# EAGLE schematic data_pro (EAGLE 7.6.0)
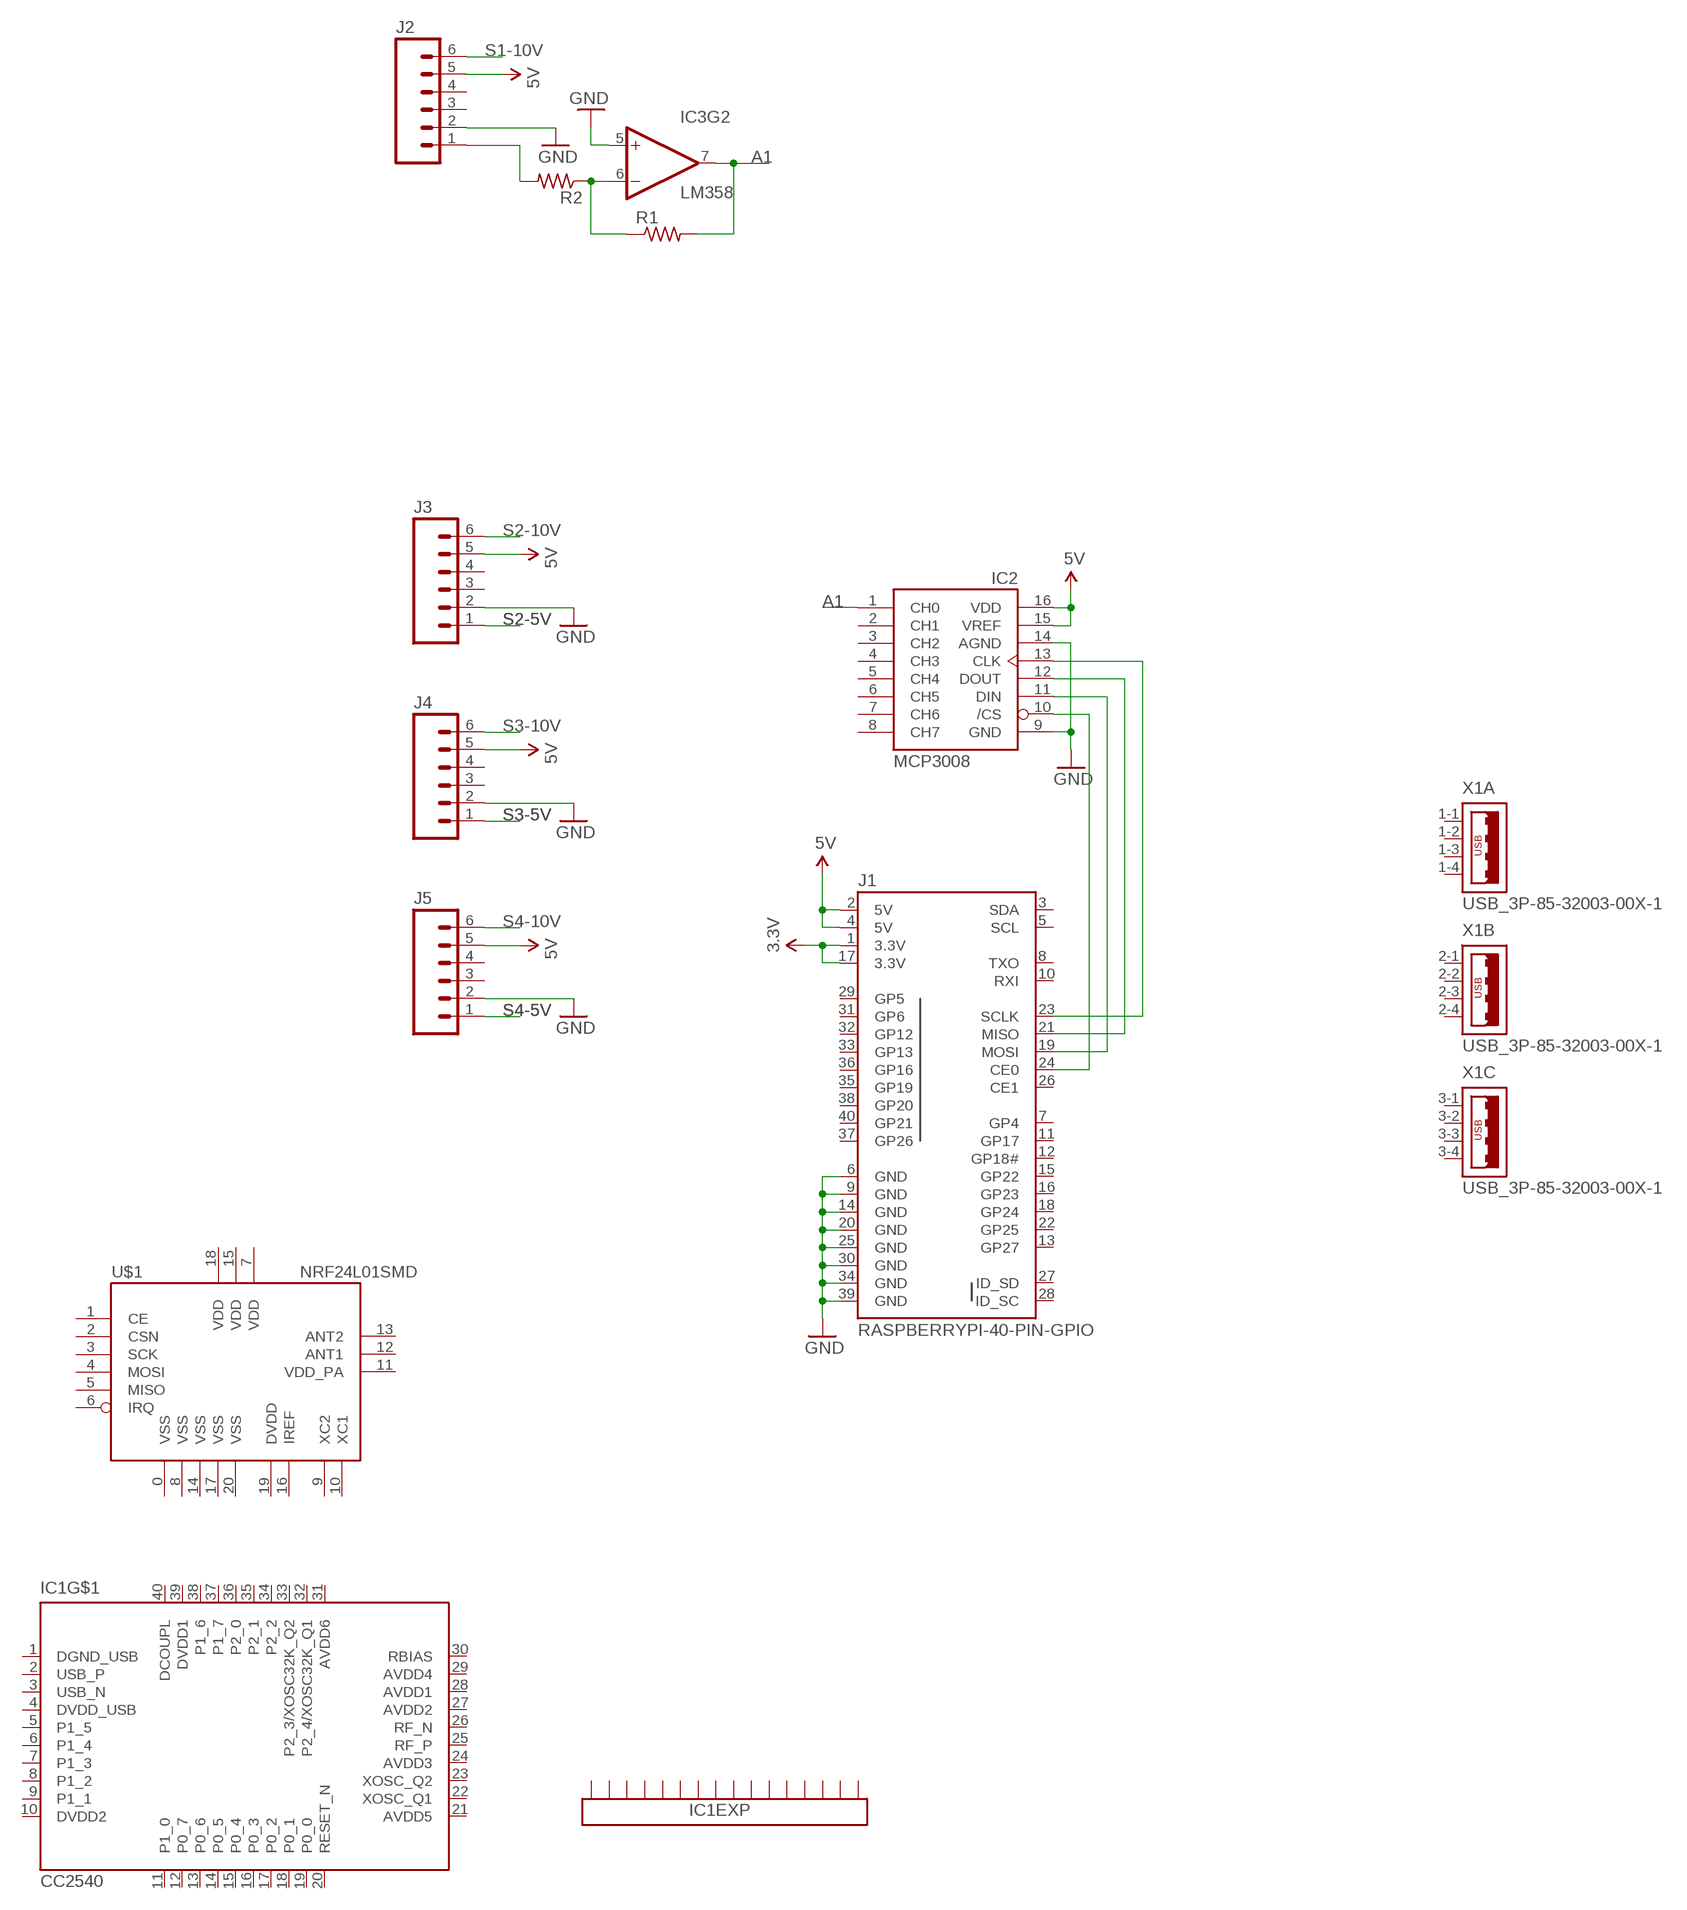
[diagram p0: schematic, sheet 1]

## Parts
IC1  CC2540  [QFN40-6X6]
IC2  MCP3008  [DIL16]
IC3  LM358  [DIP08]
J1  RASPBERRYPI-40-PIN-GPIO  [2X20-SHROUDED]
J2  M06VERNIER-ANALOG  [BTA]
J3  M06VERNIER-ANALOG  [BTA]
J4  M06VERNIER-ANALOG  [BTA]
J5  M06VERNIER-ANALOG  [BTA]
R1  R-US_R0805  [R0805]
R2  R-US_R0805  [R0805]
U$1  NRF24L01SMD  [QFN20]
X1  USB_3P-85-32003-00X-1  [85-32003-00X-1]

## Nets
3.3V: J1.1(3.3V) J1.17(3.3V)
5V: IC2.15(VREF) IC2.16(VDD) J1.2(5V) J1.4(5V) J2.5 J3.5 J4.5 J5.5
A1: IC2.1(CH0) IC3.7(OUT) R1.2
GND: IC2.9(GND) IC2.14(AGND) IC3.5(+IN) J1.6(GND) J1.9(GND) J1.14(GND) J1.20(GND) J1.25(GND) J1.30(GND) J1.34(GND) J1.39(GND) J2.2 J3.2 J4.2 J5.2
N$1: IC2.13(CLK) J1.23(SCLK)
N$2: IC2.12(DOUT) J1.21(MISO)
N$3: IC2.11(DIN) J1.19(MOSI)
N$4: IC2.10(/CS) J1.24(CE0)
N$6: IC3.6(-IN) R1.1 R2.1
S1-5V: J2.1 R2.2
S1-10V: J2.6
S2-5V: J3.1
S2-10V: J3.6
S3-5V: J4.1
S3-10V: J4.6
S4-5V: J5.1
S4-10V: J5.6
Unconnected: IC1.2(USB_P) IC1.3(USB_N) IC1.5(P1_5) IC1.6(P1_4) IC1.7(P1_3) IC1.8(P1_2) IC1.9(P1_1) IC1.11(P1_0) IC1.12(P0_7) IC1.13(P0_6) IC1.14(P0_5) IC1.15(P0_4) IC1.16(P0_3) IC1.17(P0_2) IC1.18(P0_1) IC1.19(P0_0) IC1.20(RESET_N) IC1.22(XOSC_Q1) IC1.23(XOSC_Q2) IC1.25(RF_P) IC1.26(RF_N) IC1.30(RBIAS) IC1.32(P2_4/XOSC32K_Q1) IC1.33(P2_3/XOSC32K_Q2) IC1.34(P2_2) IC1.35(P2_1) IC1.36(P2_0) IC1.37(P1_7) IC1.38(P1_6) IC1.EXP@1(EXP:EXP16) IC1.EXP@2(EXP:EXP16) IC1.EXP@3(EXP:EXP16) IC1.EXP@4(EXP:EXP16) IC1.EXP@5(EXP:EXP16) IC1.EXP@6(EXP:EXP16) IC1.EXP@7(EXP:EXP16) IC1.EXP@8(EXP:EXP16) IC1.EXP@9(EXP:EXP16) IC1.EXP@10(EXP:EXP16) IC1.EXP@11(EXP:EXP16) IC1.EXP@12(EXP:EXP16) IC1.EXP@13(EXP:EXP16) IC1.EXP@14(EXP:EXP16) IC1.EXP@15(EXP:EXP16) IC1.EXP@16(EXP:EXP16) IC2.2(CH1) IC2.3(CH2) IC2.4(CH3) IC2.5(CH4) IC2.6(CH5) IC2.7(CH6) IC2.8(CH7) IC3.1(OUT) IC3.2(-IN) IC3.3(+IN) J1.3(SDA) J1.5(SCL) J1.7(GP4) J1.8(TXO) J1.10(RXI) J1.11(GP17) J1.12(GP18#) J1.13(GP27) J1.15(GP22) J1.16(GP23) J1.18(GP24) J1.22(GP25) J1.26(CE1) J1.27(ID_SD) J1.28(ID_SC) J1.29(GP5) J1.31(GP6) J1.32(GP12) J1.33(GP13) J1.35(GP19) J1.36(GP16) J1.37(GP26) J1.38(GP20) J1.40(GP21) J2.3 J2.4 J3.3 J3.4 J4.3 J4.4 J5.3 J5.4 U$1.1(CE) U$1.2(CSN) U$1.3(SCK) U$1.4(MOSI) U$1.5(MISO) U$1.6(IRQ) U$1.9(XC2) U$1.10(XC1) U$1.12(ANT1) U$1.13(ANT2) U$1.16(IREF) X1.1-1 X1.1-2 X1.1-3 X1.1-4 X1.2-1 X1.2-2 X1.2-3 X1.2-4 X1.3-1 X1.3-2 X1.3-3 X1.3-4

## Power pins joined to a net without a drawn wire
AVDD1: IC1.28(AVDD1)
AVDD2: IC1.27(AVDD2)
AVDD3: IC1.24(AVDD3)
AVDD4: IC1.29(AVDD4)
AVDD5: IC1.21(AVDD5)
AVDD6: IC1.31(AVDD6)
DCOUPL: IC1.40(DCOUPL)
DGND_USB: IC1.1(DGND_USB)
DVDD: U$1.19(DVDD)
DVDD1: IC1.39(DVDD1)
DVDD2: IC1.10(DVDD2)
DVDD_USB: IC1.4(DVDD_USB)
V+: IC3.8(V+)
V-: IC3.4(V-)
VDD: U$1.7(VDD) U$1.15(VDD) U$1.18(VDD)
VDD_PA: U$1.11(VDD_PA)
VSS: U$1.0(VSS) U$1.8(VSS) U$1.14(VSS) U$1.17(VSS) U$1.20(VSS)

## Library data of the parts
IC1 = texas:CC2540: 2.4-GHz Bluetooth® low energy System-on-Chip Auto generated by make-symbol-device-package-bsdl.ulp Rev. 39 Source: cc2540.txt
IC2 = adafruit:MCP3008
IC3 = SparkFun-AnalogIC:LM358: Jellybean op-amp; PROD_ID: IC-09172
J1 = SparkFun-Boards:RASPBERRYPI-40-PIN-GPIO: Second Generation Raspberry Pi GPIO Header 2x20 pin connector, as found on B, B+, A+ models.
J2-J5 = SparkFun-Connectors:M06: Header 6 Standard 6-pin 0.1" header. Use with straight break away headers (SKU : PRT-00116), right angle break away headers (PRT-00553), swiss pins (PRT-00743), machine pins (PRT-00117), and female headers (PRT-00115). Molex polarized connector foot print use with SKU : PRT-08094 with associated crimp pins and housings. NOTES ON THE VARIANTS LOCK and LOCK_LONGPADS... This footprint was designed to help hold the alignment of a through-hole component (i.e. 6-pin header) while soldering it into place. You may notice that each hole has been shifted either up or down by 0.005 of an inch from it's more standard position (which is a perfectly straight line). This slight alteration caused the pins (the squares in the middle) to touch the edges of the holes. Because they are alternating, it causes a "brace" to hold the component in place. 0.005 has proven to be the perfect amount of "off-center" position when using our standard breakaway headers. Although looks a little odd when you look at the bare footprint, once you have a header in there, the alteration is very hard to notice. Also,if you push a header all the way into place, it is covered up entirely on the bottom side. This idea of altering the position of holes to aid alignment will be further integrated into the Sparkfun Library for other footprints. It can help hold any component with 3 or more connection pins.
R1 R2 = resistor:R-US_: RESISTOR, American symbol
U$1 = SparkFun-RF:NRF24L01: 2.4GHz Low Power Transceiver This is the very popular, low cost, very low power RF transceiver from Nordic Semiconductor. Simple SPI interface. SKU: COM-00690
X1 = con-cypressindustries:USB_3P-: Triple USB Connector Source: www.cypressindustries.com; OC_FARNELL: unknown; OC_NEWARK: unknown